# Altium schematic sheet DX-ATGM336H_SCH_Part_AD.SchDoc
size A4; SheetNumber: 1; SheetTotal: 1
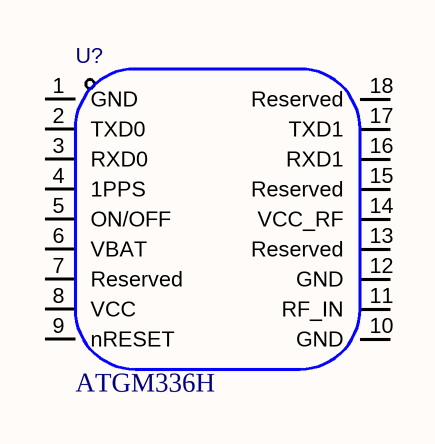
[diagram p0: DX-ATGM336H_SCH_Part_AD.SchDoc]

## Parts
U?  ATGM336H

## Nets

Not connected (* = marked no-connect by the designer): U? 1(GND) 2(TXD0) 3(RXD0) 4(1PPS) 5(ON/OFF) 6(VBAT) 7(Reserved) 8(VCC) 9(nRESET) 10(GND) 11(RF_IN) 12(GND) 13(Reserved) 14(VCC_RF) 15(Reserved) 16(RXD1) 17(TXD1) 18(Reserved)

## Library data of the parts
U? = ATGM336H: Symbol: ATGM336H-6N-22